# EasyEDA schematic 1-Schematic_Task.json
TITLE: Sheet_1; REV: 1.0; Date: 2021-05-29; Sheet: 1/1; Company: Your Company
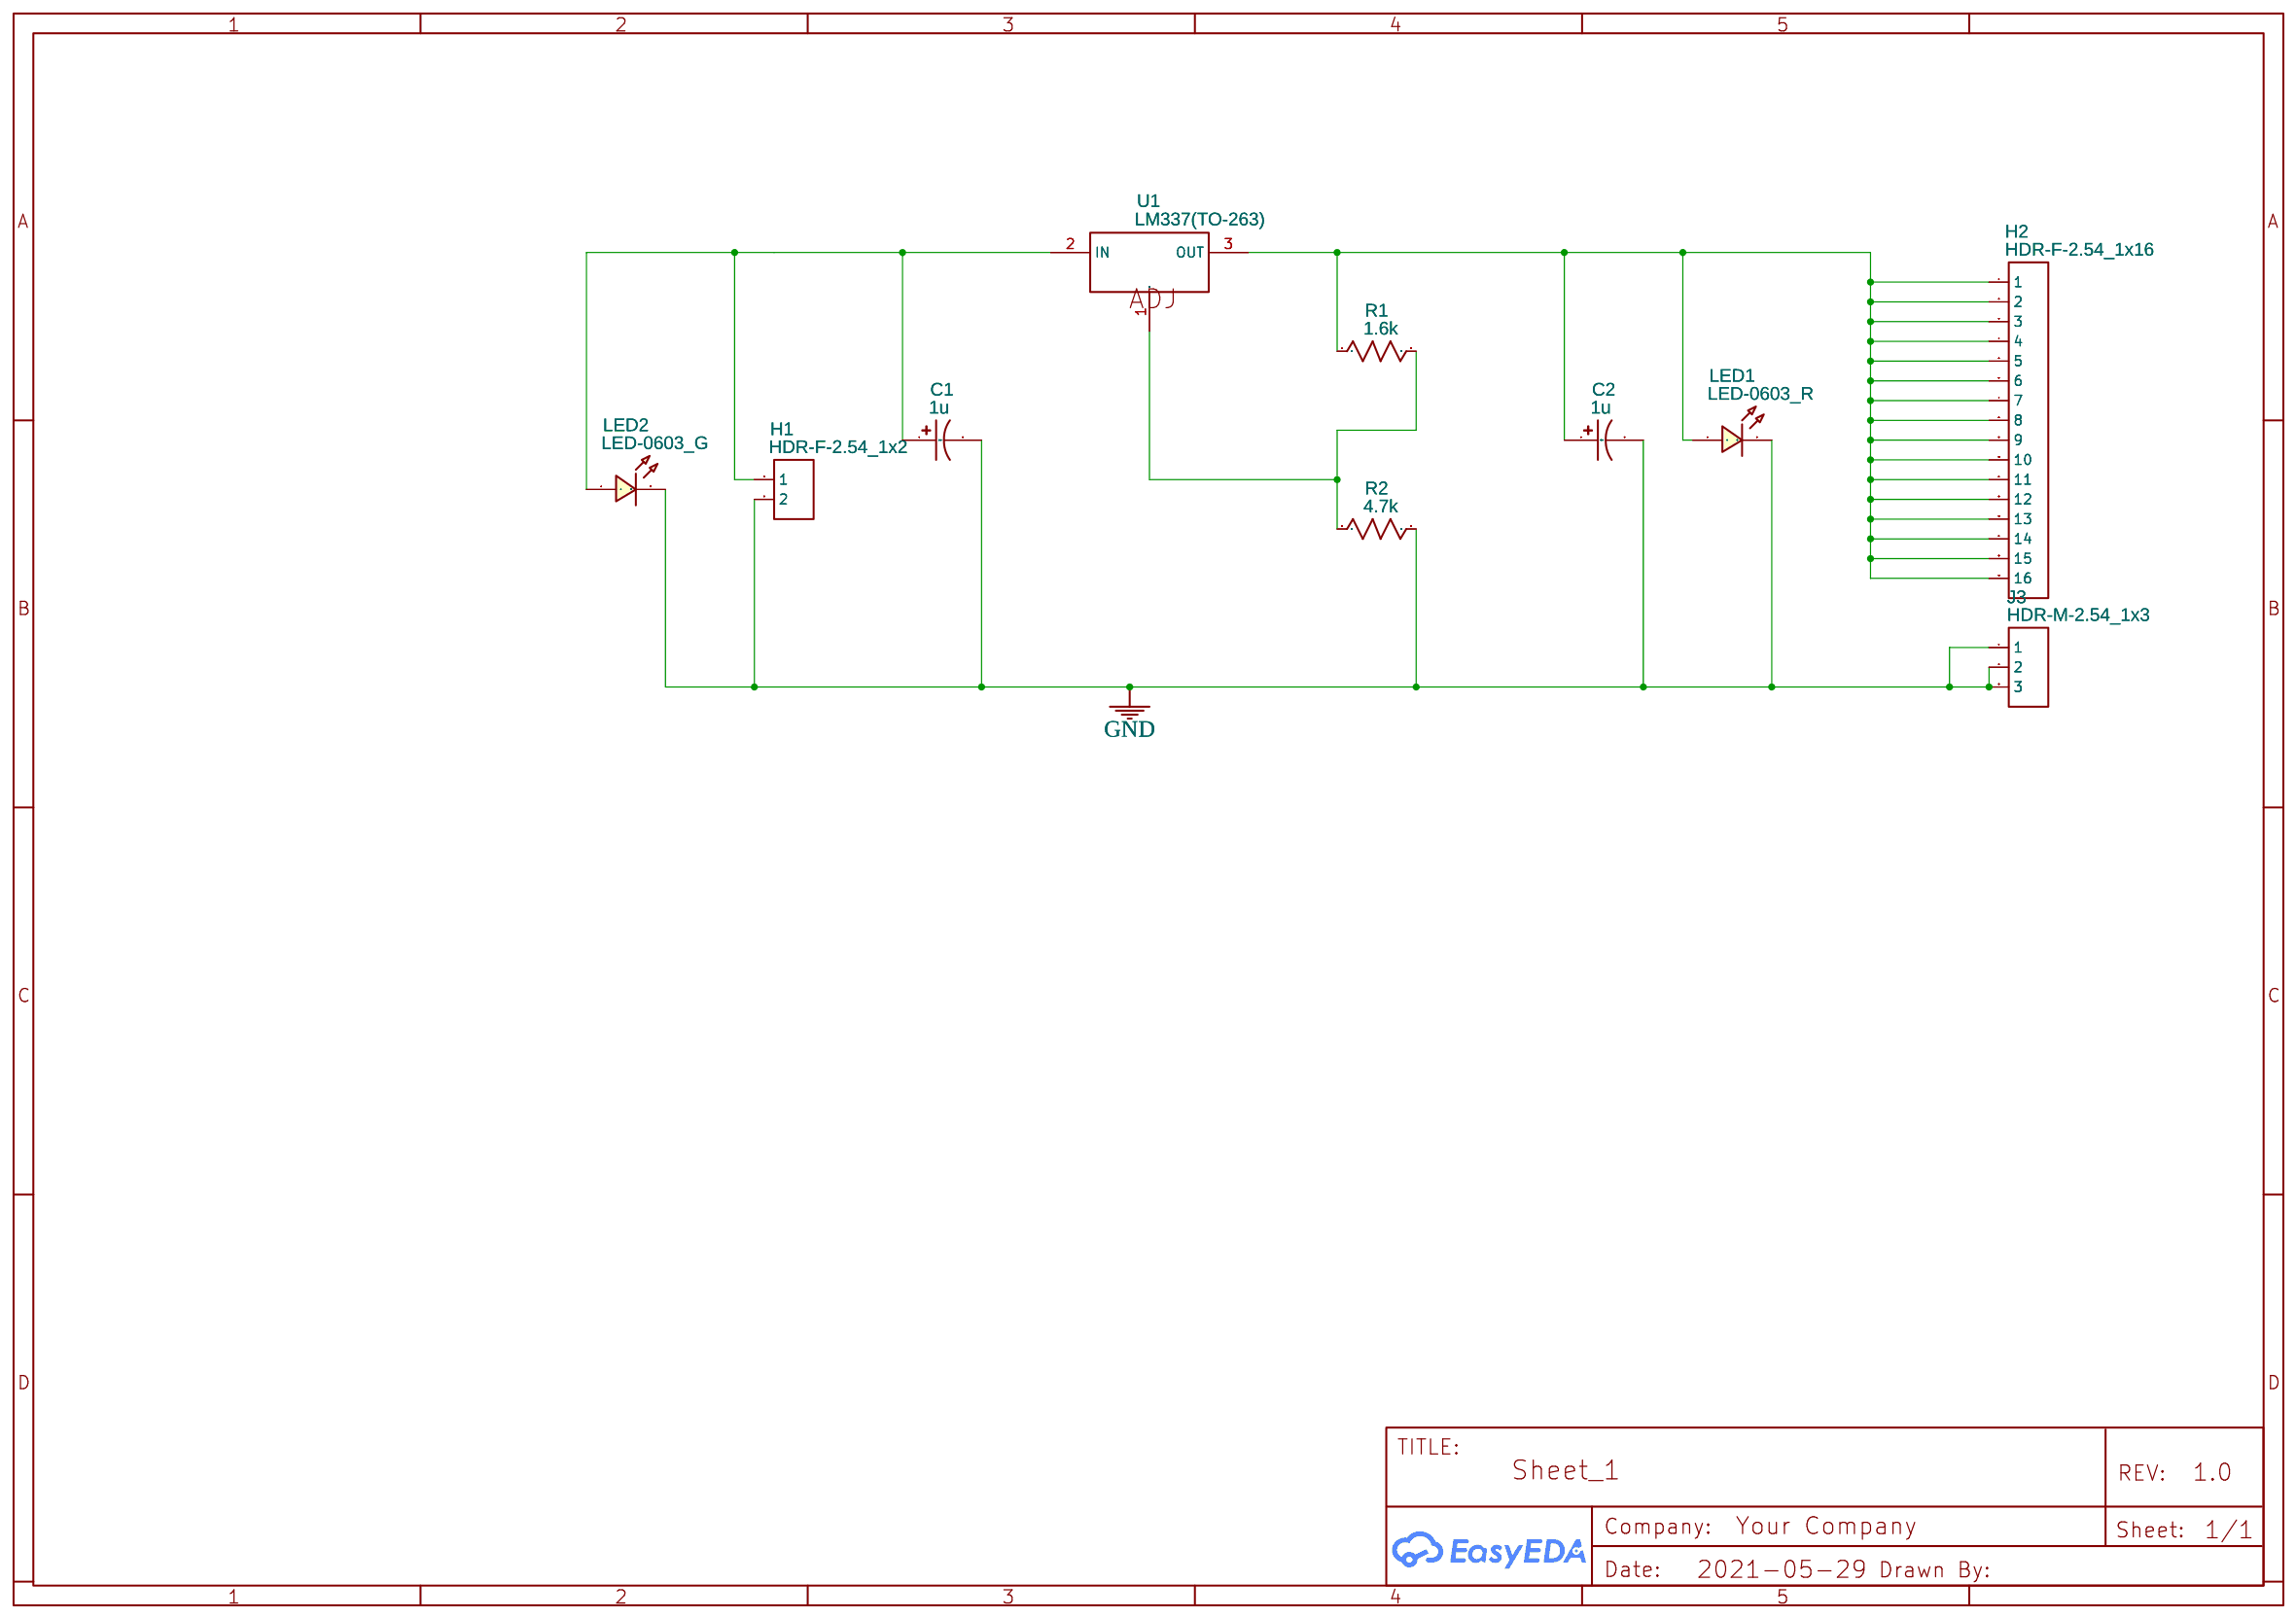
[diagram p0: schematic sheet]

## Parts
C1  1u  [CASE-A_3216]
C2  1u  [CASE-A_3216]
H1  HDR-F-2.54_1x2  [HDR-F-2.54_1X2]
H2  HDR-F-2.54_1x16  [HDR-F-2.54_1X16]
J3  HDR-M-2.54_1x3  [HDR-M-2.54_1X3]
LED1  LED-0603_R  [LED0603_RED]
LED2  LED-0603_G  [LED0603_GREEN]
R1  1.6k  [R0603]
R2  4.7k  [R0603]
U1  LM337(TO-263)  [TO-263-2_L10.1-W9.1-P5.08-LS15.2-BR]

## Library data of the parts
C1 C2 = C_Tan_SMD_A_US: Contributor: LCEDA_Lib
H1 = HDR-F-2.54_1x2: Supplier Part: C49661; Supplier: LCSC; Contributor: LCEDA_Lib
H2 = HDR-F-2.54_1x16: Supplier Part: C66987; Supplier: LCSC; Contributor: LCEDA_Lib
J3 = HDR-M-2.54_1x3: Supplier Part: C180248; Supplier: LCSC; Contributor: LCEDA_Lib
LED1 = LED-0603_R: Manufacturer: EVERLIGHT(台湾亿光); Manufacturer Part: 19-217/R6C-AL1M2VY/3T; Supplier Part: C72044; Supplier: LCSC; Contributor: LCEDA_01
LED2 = LED-0603_G: Manufacturer: EVERLIGHT(台湾亿光); Manufacturer Part: 19-217/GHC-YR1S2/3T; Supplier Part: C72043; Supplier: LCSC; Contributor: LCEDA_Lib
R1 R2 = R_0603_US: Contributor: LCEDA_Lib
U1 = LM337(TO-263): Supplier: LCSC; Manufacturer: ON; Manufacturer Part: LM337D2TG; Contributor: LCEDA_Lib; Supplier Part: C146782

## Nets
GND: C1.2 C2.2 H1.2 J3.1 J3.2 J3.3 LED1.2 LED2.2 R2.2
Net-(C1-1): C1.1 H1.1 LED2.1 U1.2(IN)
Net-(C2-1): C2.1 H2.1 H2.2 H2.3 H2.4 H2.5 H2.6 H2.7 H2.8 H2.9 H2.10 H2.11 H2.12 H2.13 H2.14 H2.15 H2.16 LED1.1 R1.1 U1.3(OUT)
Net-(R1-2): R1.2 R2.1 U1.1(ADJ)
